# Altium schematic sheet Architecture.SchDoc: System Architecture
size 420 x 297 mm; SheetNumber: 1; SheetTotal: 2; DOC_NO_SCH_DWG: 1
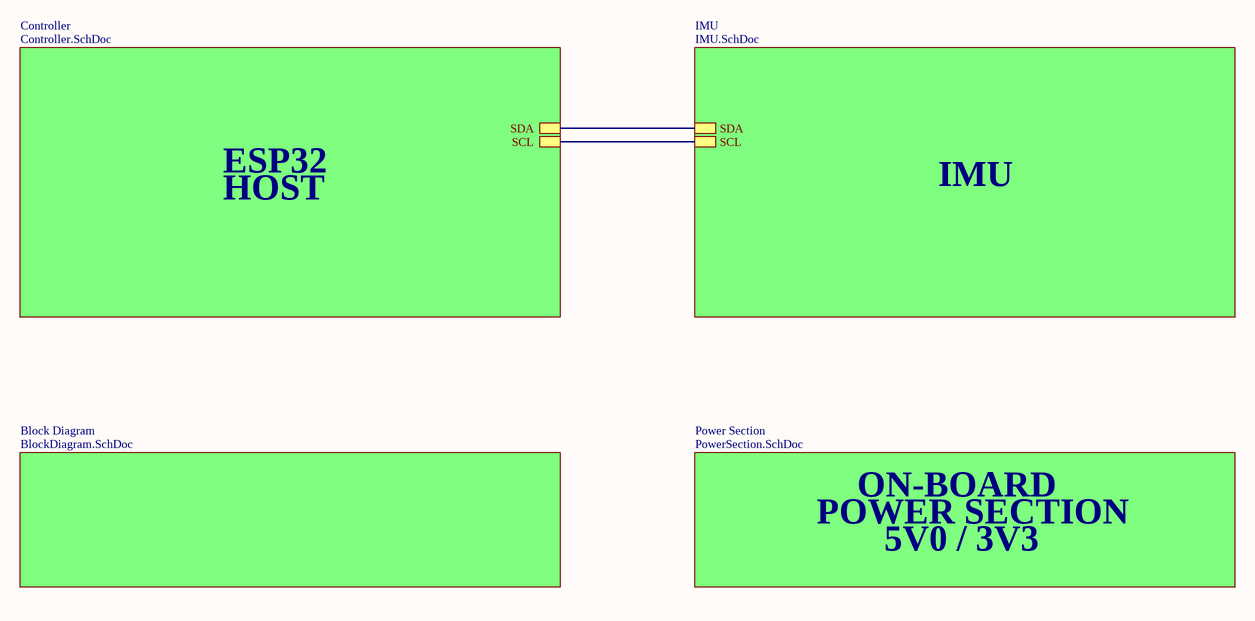
[diagram p0: Architecture.SchDoc]

## Sub-sheets
Block Diagram = BlockDiagram.SchDoc: no entries
Controller = Controller.SchDoc: SDA, SCL
IMU = IMU.SchDoc: SDA, SCL
Power Section = PowerSection.SchDoc: no entries

## Nets
(unnamed): sheet Controller/SDA, sheet IMU/SDA
(unnamed): sheet Controller/SCL, sheet IMU/SCL

## Notes on the sheet
- HOST
- ESP32
- IMU
- POWER SECTION
- ON-BOARD
- 5V0 / 3V3
- PROJECT
- SIZE
- FILE NAME
- A3
- TITLE
- SHEET
- OF
- REV